# EAGLE schematic funk (EAGLE 7.3.0)
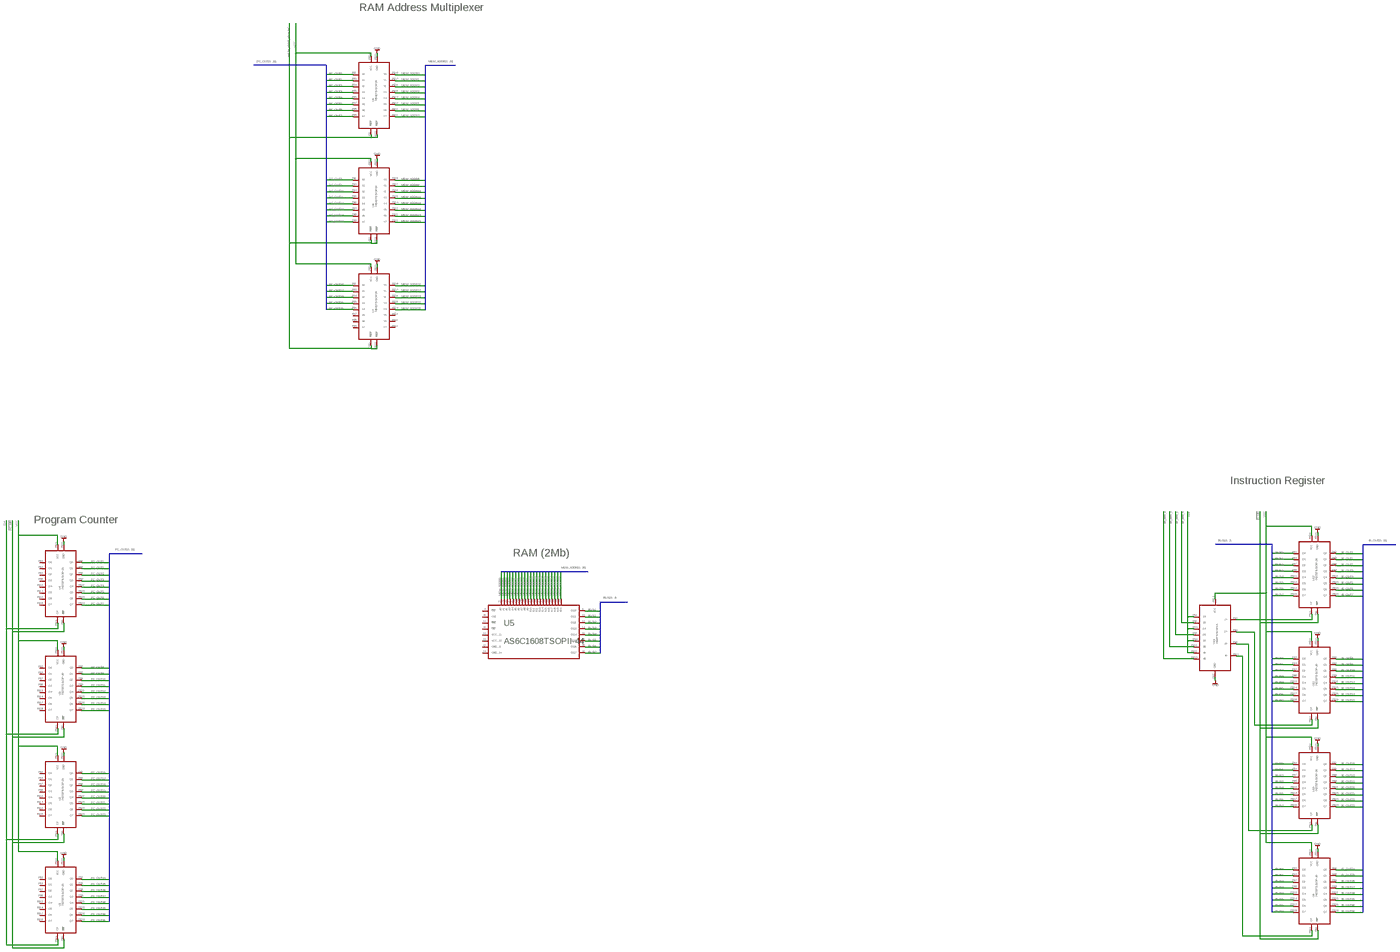
[diagram p0: schematic, sheet 1, overview]
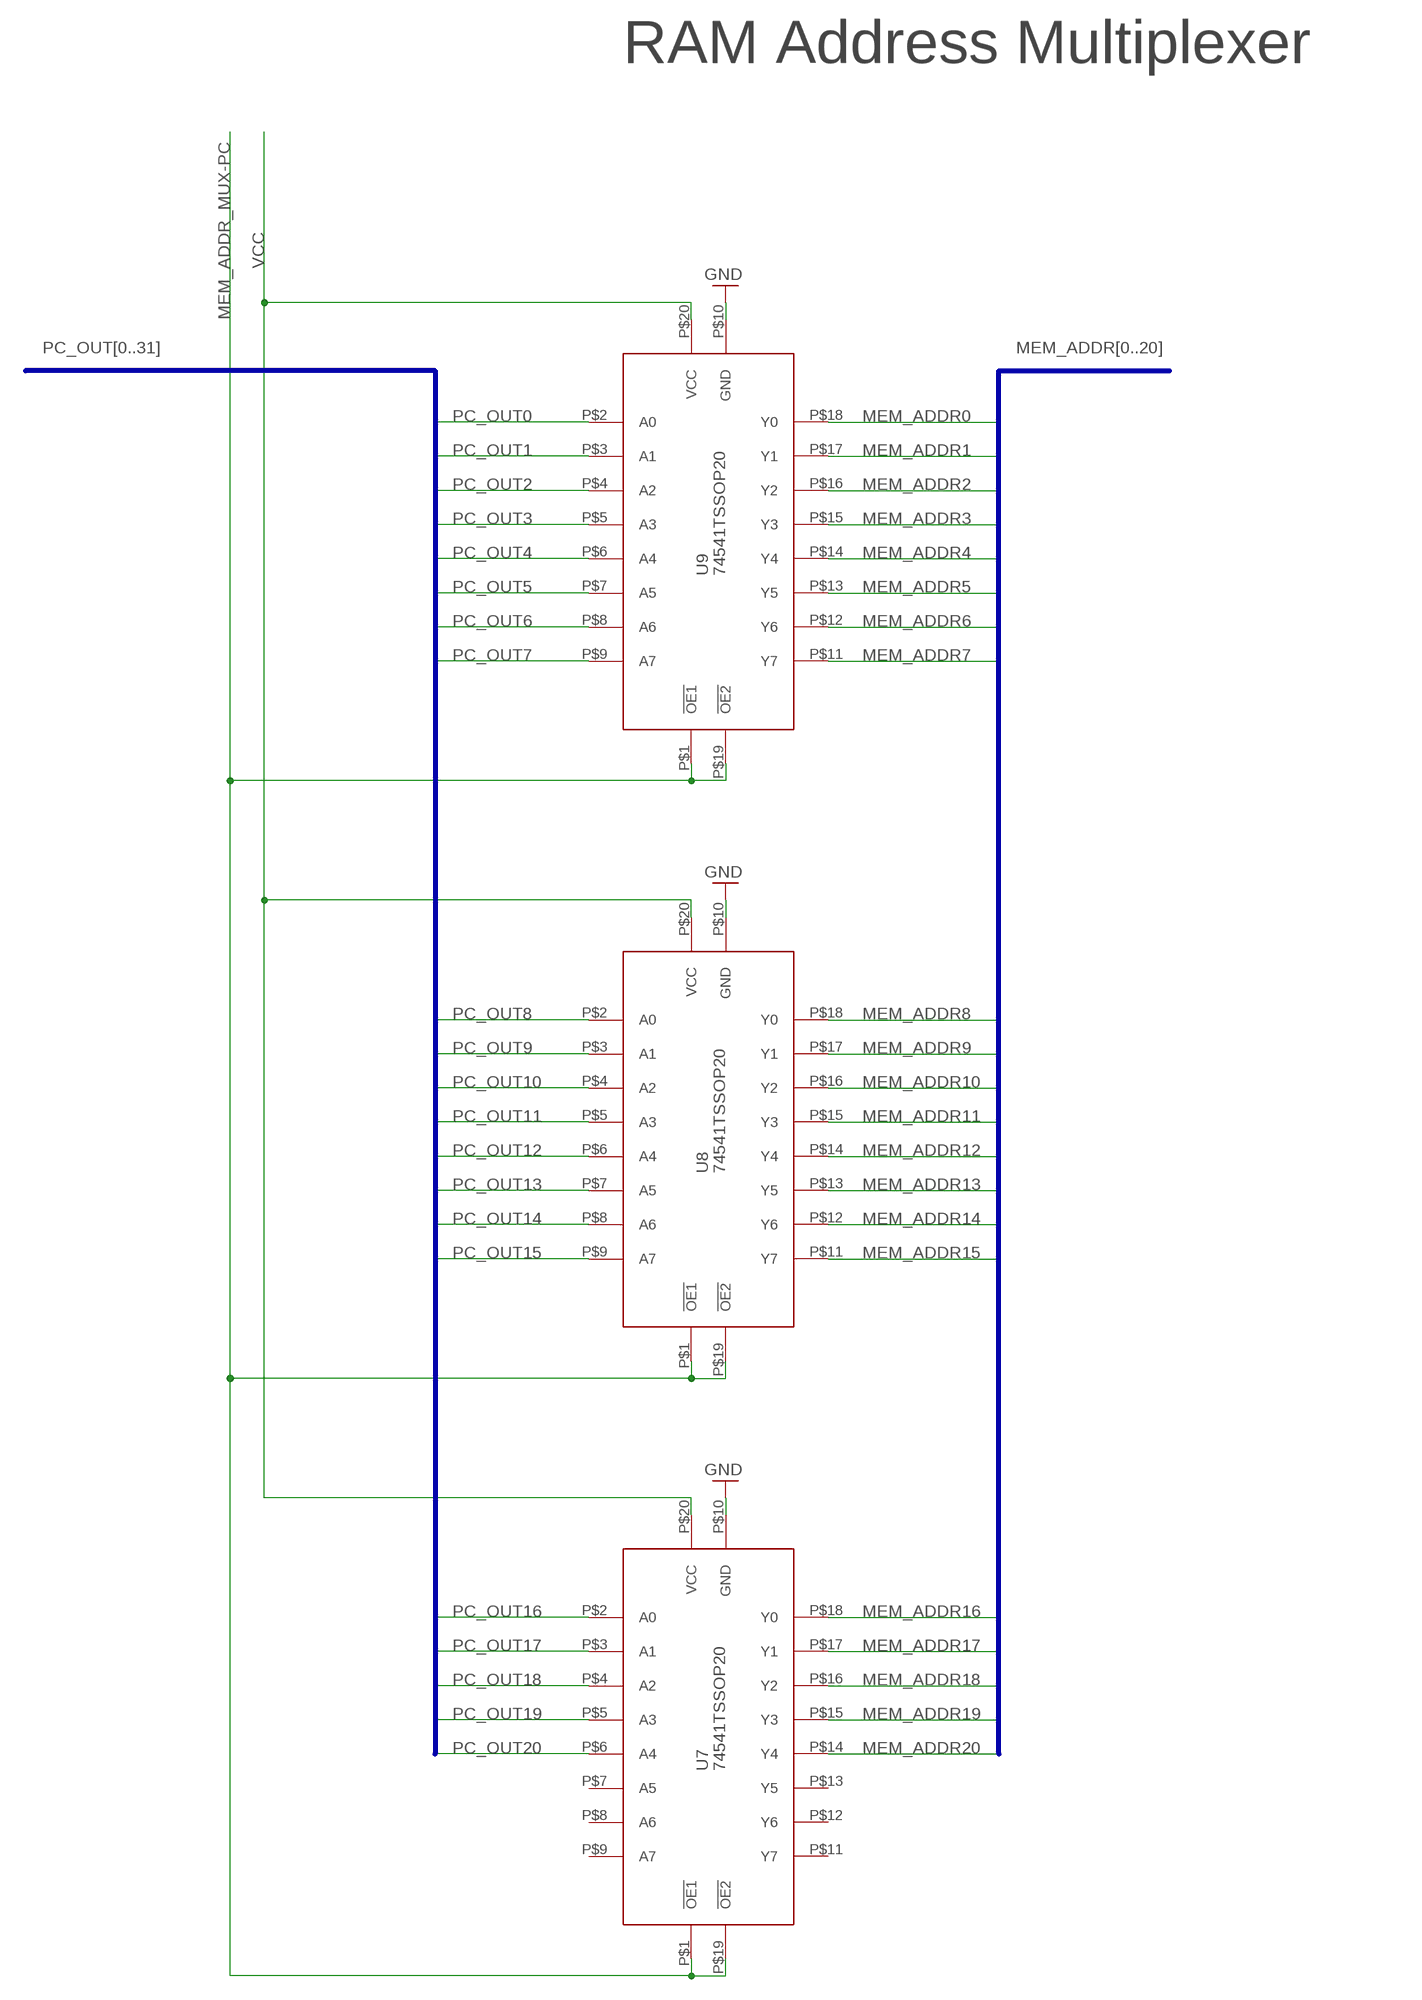
[diagram p1: schematic, sheet 1, part 1 of 4]
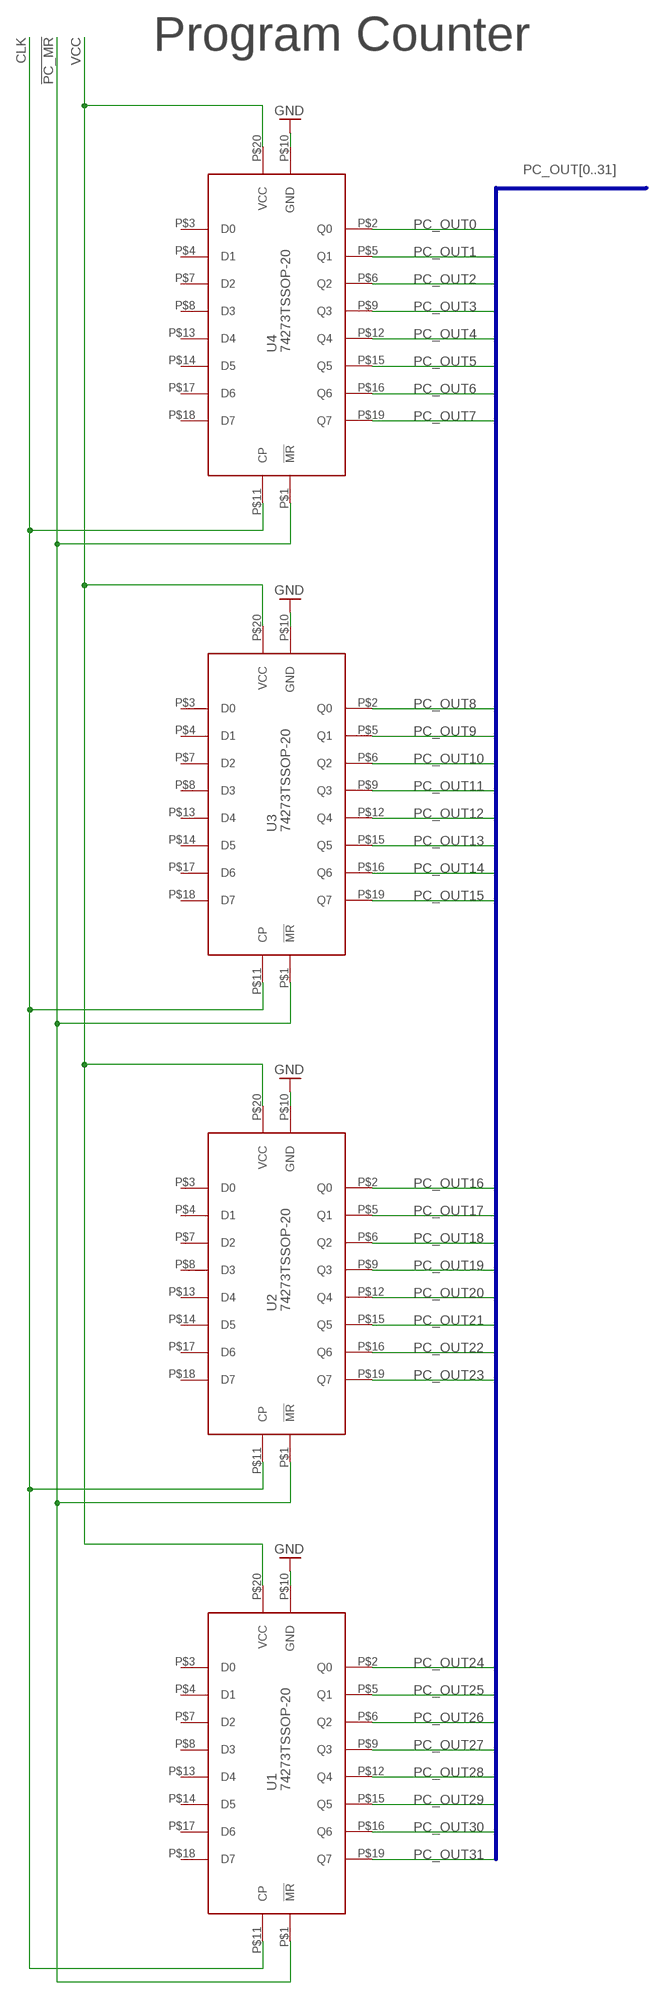
[diagram p2: schematic, sheet 1, part 2 of 4]
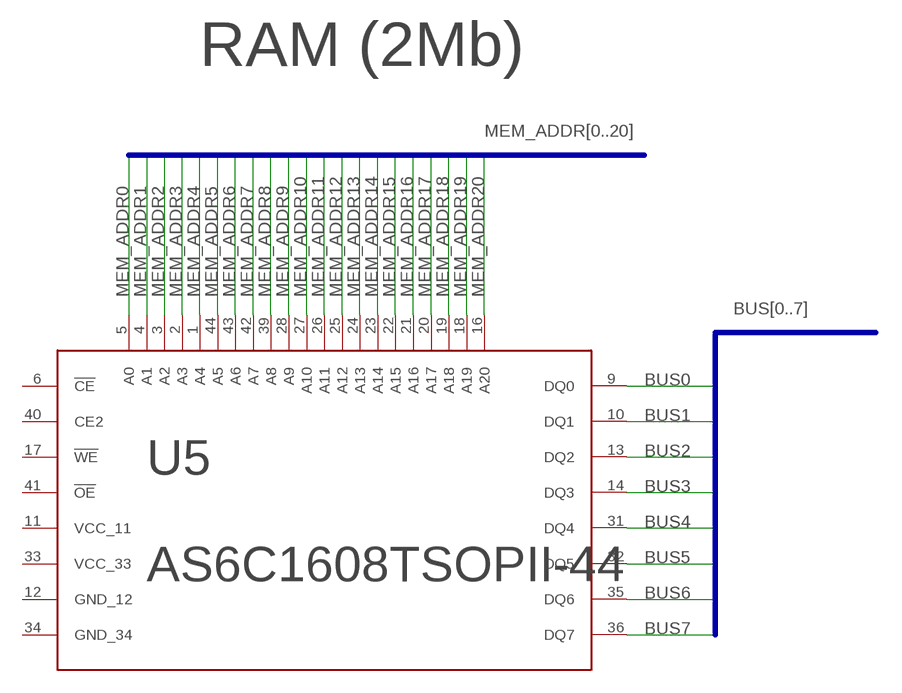
[diagram p3: schematic, sheet 1, part 3 of 4]
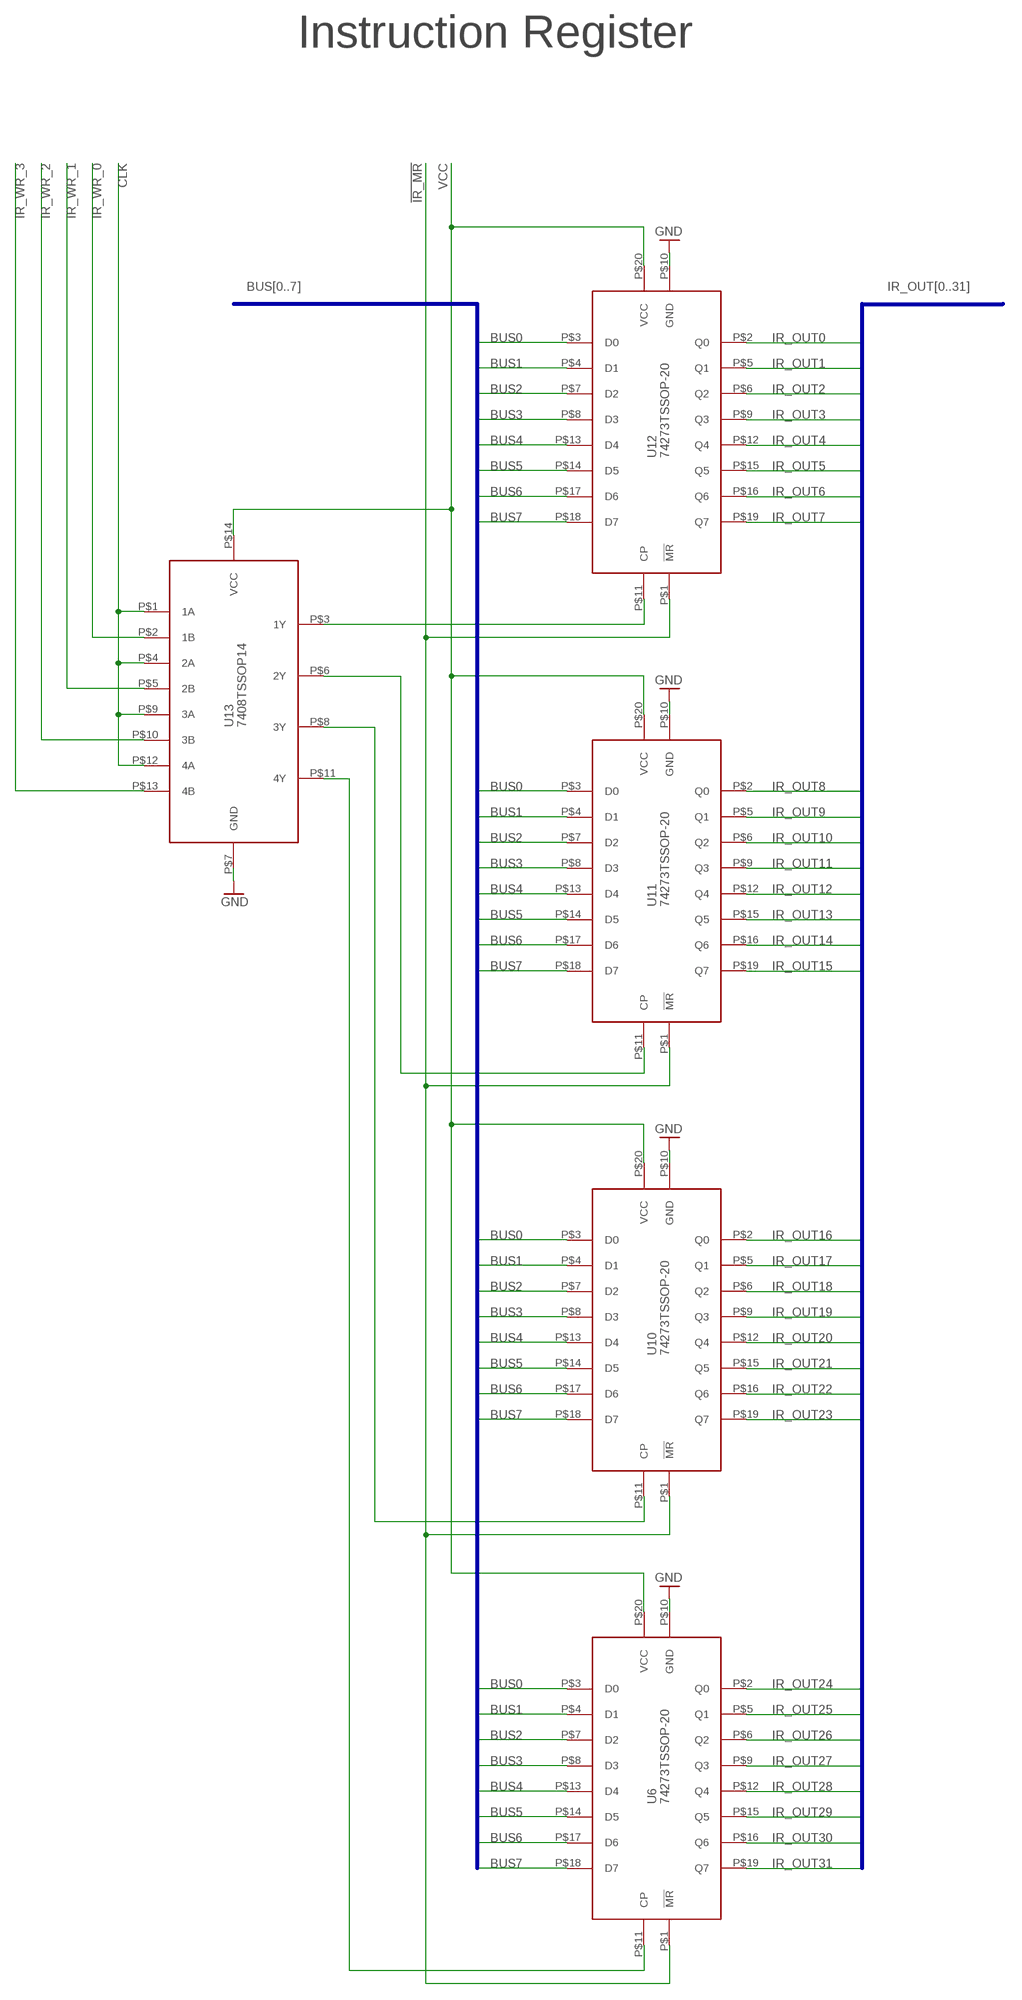
[diagram p4: schematic, sheet 1, part 4 of 4]

## Parts
U1  74273TSSOP-20  [TSSOP-20]
U2  74273TSSOP-20  [TSSOP-20]
U3  74273TSSOP-20  [TSSOP-20]
U4  74273TSSOP-20  [TSSOP-20]
U5  AS6C1608TSOPII-44  [TSOPII-44]
U6  74273TSSOP-20  [TSSOP-20]
U7  74541TSSOP20  [TSSOP-20]
U8  74541TSSOP20  [TSSOP-20]
U9  74541TSSOP20  [TSSOP-20]
U10  74273TSSOP-20  [TSSOP-20]
U11  74273TSSOP-20  [TSSOP-20]
U12  74273TSSOP-20  [TSSOP-20]
U13  7408TSSOP14  [TSSOP-14]

## Nets
!IR_MR: U6.P$1(!MR) U10.P$1(!MR) U11.P$1(!MR) U12.P$1(!MR)
!PC_MR: U1.P$1(!MR) U2.P$1(!MR) U3.P$1(!MR) U4.P$1(!MR)
BUS0: U5.9(DQ0) U6.P$3(D0) U10.P$3(D0) U11.P$3(D0) U12.P$3(D0)
BUS1: U5.10(DQ1) U6.P$4(D1) U10.P$4(D1) U11.P$4(D1) U12.P$4(D1)
BUS2: U5.13(DQ2) U6.P$7(D2) U10.P$7(D2) U11.P$7(D2) U12.P$7(D2)
BUS3: U5.14(DQ3) U6.P$8(D3) U10.P$8(D3) U11.P$8(D3) U12.P$8(D3)
BUS4: U5.31(DQ4) U6.P$13(D4) U10.P$13(D4) U11.P$13(D4) U12.P$13(D4)
BUS5: U5.32(DQ5) U6.P$14(D5) U10.P$14(D5) U11.P$14(D5) U12.P$14(D5)
BUS6: U5.35(DQ6) U6.P$17(D6) U10.P$17(D6) U11.P$17(D6) U12.P$17(D6)
BUS7: U5.36(DQ7) U6.P$18(D7) U10.P$18(D7) U11.P$18(D7) U12.P$18(D7)
CLK: U1.P$11(CP) U2.P$11(CP) U3.P$11(CP) U4.P$11(CP) U10.P$11(CP) U13.P$1(1A) U13.P$4(2A) U13.P$8(3Y) U13.P$9(3A) U13.P$12(4A)
GND: U1.P$10(GND) U2.P$10(GND) U3.P$10(GND) U4.P$10(GND) U6.P$10(GND) U7.P$10(GND) U8.P$10(GND) U9.P$10(GND) U10.P$10(GND) U11.P$10(GND) U12.P$10(GND) U13.P$7(GND)
IR_OUT0: U12.P$2(Q0)
IR_OUT1: U12.P$5(Q1)
IR_OUT2: U12.P$6(Q2)
IR_OUT3: U12.P$9(Q3)
IR_OUT4: U12.P$12(Q4)
IR_OUT5: U12.P$15(Q5)
IR_OUT6: U12.P$16(Q6)
IR_OUT7: U12.P$19(Q7)
IR_OUT8: U11.P$2(Q0)
IR_OUT9: U11.P$5(Q1)
IR_OUT10: U11.P$6(Q2)
IR_OUT11: U11.P$9(Q3)
IR_OUT12: U11.P$12(Q4)
IR_OUT13: U11.P$15(Q5)
IR_OUT14: U11.P$16(Q6)
IR_OUT15: U11.P$19(Q7)
IR_OUT16: U10.P$2(Q0)
IR_OUT17: U10.P$5(Q1)
IR_OUT18: U10.P$6(Q2)
IR_OUT19: U10.P$9(Q3)
IR_OUT20: U10.P$12(Q4)
IR_OUT21: U10.P$15(Q5)
IR_OUT22: U10.P$16(Q6)
IR_OUT23: U10.P$19(Q7)
IR_OUT24: U6.P$2(Q0)
IR_OUT25: U6.P$5(Q1)
IR_OUT26: U6.P$6(Q2)
IR_OUT27: U6.P$9(Q3)
IR_OUT28: U6.P$12(Q4)
IR_OUT29: U6.P$15(Q5)
IR_OUT30: U6.P$16(Q6)
IR_OUT31: U6.P$19(Q7)
IR_WR_0: U13.P$2(1B)
IR_WR_1: U13.P$5(2B)
IR_WR_2: U13.P$10(3B)
IR_WR_3: U13.P$13(4B)
MEM_ADDR0: U5.5(A0) U9.P$18(Y0)
MEM_ADDR1: U5.4(A1) U9.P$17(Y1)
MEM_ADDR2: U5.3(A2) U9.P$16(Y2)
MEM_ADDR3: U5.2(A3) U9.P$15(Y3)
MEM_ADDR4: U5.1(A4) U9.P$14(Y4)
MEM_ADDR5: U5.44(A5) U9.P$13(Y5)
MEM_ADDR6: U5.43(A6) U9.P$12(Y6)
MEM_ADDR7: U5.42(A7) U9.P$11(Y7)
MEM_ADDR8: U5.39(A8) U8.P$18(Y0)
MEM_ADDR9: U5.28(A9) U8.P$17(Y1)
MEM_ADDR10: U5.27(A10) U8.P$16(Y2)
MEM_ADDR11: U5.26(A11) U8.P$15(Y3)
MEM_ADDR12: U5.25(A12) U8.P$14(Y4)
MEM_ADDR13: U5.24(A13) U8.P$13(Y5)
MEM_ADDR14: U5.23(A14) U8.P$12(Y6)
MEM_ADDR15: U5.22(A15) U8.P$11(Y7)
MEM_ADDR16: U5.21(A16) U7.P$18(Y0)
MEM_ADDR17: U5.20(A17) U7.P$17(Y1)
MEM_ADDR18: U5.19(A18) U7.P$16(Y2)
MEM_ADDR19: U5.18(A19) U7.P$15(Y3)
MEM_ADDR20: U5.16(A20) U7.P$14(Y4)
MEM_ADDR_MUX-PC: U7.P$1(!OE1) U7.P$19(!OE2) U8.P$1(!OE1) U8.P$19(!OE2) U9.P$1(!OE1) U9.P$19(!OE2)
N$1: U12.P$11(CP) U13.P$3(1Y)
N$2: U11.P$11(CP) U13.P$6(2Y)
N$3: U6.P$11(CP) U13.P$11(4Y)
PC_OUT0: U4.P$2(Q0) U9.P$2(A0)
PC_OUT1: U4.P$5(Q1) U9.P$3(A1)
PC_OUT2: U4.P$6(Q2) U9.P$4(A2)
PC_OUT3: U4.P$9(Q3) U9.P$5(A3)
PC_OUT4: U4.P$12(Q4) U9.P$6(A4)
PC_OUT5: U4.P$15(Q5) U9.P$7(A5)
PC_OUT6: U4.P$16(Q6) U9.P$8(A6)
PC_OUT7: U4.P$19(Q7) U9.P$9(A7)
PC_OUT8: U3.P$2(Q0) U8.P$2(A0)
PC_OUT9: U3.P$5(Q1) U8.P$3(A1)
PC_OUT10: U3.P$6(Q2) U8.P$4(A2)
PC_OUT11: U3.P$9(Q3) U8.P$5(A3)
PC_OUT12: U3.P$12(Q4) U8.P$6(A4)
PC_OUT13: U3.P$15(Q5) U8.P$7(A5)
PC_OUT14: U3.P$16(Q6) U8.P$8(A6)
PC_OUT15: U3.P$19(Q7) U8.P$9(A7)
PC_OUT16: U2.P$2(Q0) U7.P$2(A0)
PC_OUT17: U2.P$5(Q1) U7.P$3(A1)
PC_OUT18: U2.P$6(Q2) U7.P$4(A2)
PC_OUT19: U2.P$9(Q3) U7.P$5(A3)
PC_OUT20: U2.P$12(Q4) U7.P$6(A4)
PC_OUT21: U2.P$15(Q5)
PC_OUT22: U2.P$16(Q6)
PC_OUT23: U2.P$19(Q7)
PC_OUT24: U1.P$2(Q0)
PC_OUT25: U1.P$5(Q1)
PC_OUT26: U1.P$6(Q2)
PC_OUT27: U1.P$9(Q3)
PC_OUT28: U1.P$12(Q4)
PC_OUT29: U1.P$15(Q5)
PC_OUT30: U1.P$16(Q6)
PC_OUT31: U1.P$19(Q7)
VCC: U1.P$20(VCC) U2.P$20(VCC) U3.P$20(VCC) U4.P$20(VCC) U6.P$20(VCC) U7.P$20(VCC) U8.P$20(VCC) U9.P$20(VCC) U10.P$20(VCC) U11.P$20(VCC) U12.P$20(VCC) U13.P$14(VCC)
Unconnected: U1.P$3(D0) U1.P$4(D1) U1.P$7(D2) U1.P$8(D3) U1.P$13(D4) U1.P$14(D5) U1.P$17(D6) U1.P$18(D7) U2.P$3(D0) U2.P$4(D1) U2.P$7(D2) U2.P$8(D3) U2.P$13(D4) U2.P$14(D5) U2.P$17(D6) U2.P$18(D7) U3.P$3(D0) U3.P$4(D1) U3.P$7(D2) U3.P$8(D3) U3.P$13(D4) U3.P$14(D5) U3.P$17(D6) U3.P$18(D7) U4.P$3(D0) U4.P$4(D1) U4.P$7(D2) U4.P$8(D3) U4.P$13(D4) U4.P$14(D5) U4.P$17(D6) U4.P$18(D7) U5.6(!CE) U5.11(VCC_11) U5.12(GND_12) U5.17(!WE) U5.33(VCC_33) U5.34(GND_34) U5.40(CE2) U5.41(!OE) U7.P$7(A5) U7.P$8(A6) U7.P$9(A7) U7.P$11(Y7) U7.P$12(Y6) U7.P$13(Y5)

## Buses
PC_OUT[0..31]
MEM_ADDR[0..20]
BUS[0..7]
IR_OUT[0..31]

## Notes on the sheet
- RAM Address Multiplexer
- Instruction Register
- Program Counter
- RAM (2Mb)

## Library data of the parts
U1-U4 U6 U10-U12 = dooba:74273
U5 = dooba:AS6C1608
U7-U9 = dooba:74541
U13 = dooba:7408